# Altium schematic sheet System Input.SchDoc
size A
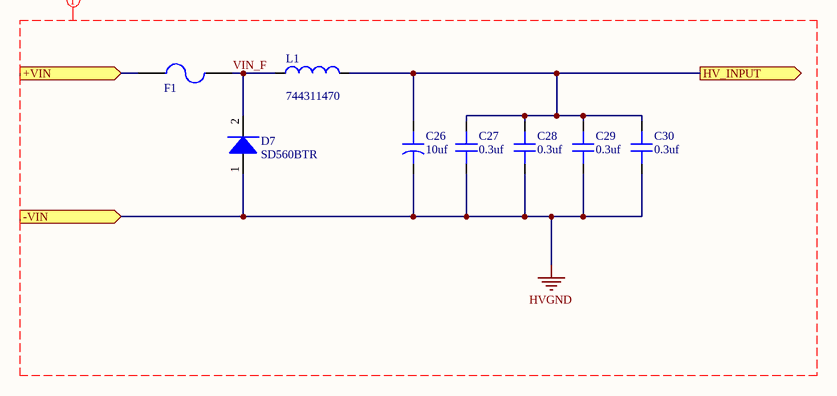
[diagram p0: System Input.SchDoc]

## Parts
C26  value 10uf  [CAP AL TH D10 L5 H30]  (hidden comment: Capacitor Electrolytic 10uf 500V CAP D10_31.5)
C27  value 0.3uf  [CAP 1812/4532 2.8MM]  (hidden comment: Capacitor MLCC 0.3uf 630V CAP 1812/4532)
C28  value 0.3uf  [CAP 1812/4532 2.8MM]  (hidden comment: Capacitor MLCC 0.3uf 630V CAP 1812/4532)
C29  value 0.3uf  [CAP 1812/4532 2.8MM]  (hidden comment: Capacitor MLCC 0.3uf 630V CAP 1812/4532)
C30  value 0.3uf  [CAP 1812/4532 2.8MM]  (hidden comment: Capacitor MLCC 0.3uf 630V CAP 1812/4532)
D7  SD560BTR  [DO214AA_ SD560BTR]
F1  Fuse  [04853,15DR]  (value not drawn)
L1  (no value)  [744311470]

## Ports
+VIN (in), -VIN (in), HV_INPUT (out)

## Nets
HVGND: C26.2 C27.1 C28.1 C29.1 C30.1 D7.1(A) ; port -VIN
+VIN: F1.1 ; port +VIN
HV_INPUT: C26.1 C27.2 C28.2 C29.2 C30.2 L1.2 ; port HV_INPUT
VIN_F: D7.2(K) F1.2 L1.1

## Layout directives
net class HV: HVGND, VIN_F

## Library data of the parts
C26 = 1093: 10µF 500V Aluminum Electrolytic Capacitors Radial, Can  8000 Hrs @ 105°C; Manufacturer_id: 1; MfrPartNo: EKXJ501ELL100MJ30S; idCapacitor: 1093; Name: Cap_10uf_500V_CAP D10_31.5; Created_By: Nick Mah; Supplier 1: Digi-Key; Supplier Part Number 1: 565-4930-ND; Drawer_id: 1; Voltage_Rating: 500V; Dielectric: Electrolytic; Package: TH D10_31.5; Link: https://www.digikey.com/product-detail/en/united-chemi-con/EKXJ501ELL100MJ30S/565-4930-ND/7809906; ComponentLink1Description: Datasheet; ComponentLink1URL: http://www.chemi-con.com/upload/files/7/6/113326760852d6c4ba03a36.pdf
C27-C30 = 1089: Null; Manufacturer_id: 1; MfrPartNo: C4532X7T2J304K250KA; idCapacitor: 1089; Name: Cap_0.3uf_630V_CAP 1812/4532; Dielectric: Ceramic; Tolerance: 10%; Created_By: Jason Zhou; Supplier 1: Digi-Key; Supplier Part Number 1: 445-13458-1-ND; Drawer_id: 1; Voltage_Rating: 630V; Package: CAP 1812/4532; Link: https://www.digikey.com/product-detail/en/tdk-corporation/C4532X7T2J304K250KA/445-13458-1-ND/3955124; ComponentLink1Description: Datasheet; ComponentLink1URL: https://product.tdk.com/info/en/catalog/datasheets/mlcc_commercial_midvoltage_en.pdf; Created_Date: 4/10/2019
D7 = 18: Diode Standard 600V 5A Surface Mount SMB; Manufacturer_id: 1; idDiode: 18; Value: 1.2V @ 5A; Created_By: Jason Zhou; mfrpartno: SD560BTR; Drawer_id: 1; Name: SD560BTR; Type: Standard; Num_Circuits: 1; Ic: 5A; Package: SMB; Link: https://www.digikey.com/product-detail/en/smc-diode-solutions/SD560BTR/1655-1530-1-ND/6022975; ComponentLink1Description: Datasheet; ComponentLink1URL: http://www.smc-diodes.com/propdf/SD560B%20N1412%20REV.D.pdf; Supplier1: Digi-Key; Supplier1PartNo: 1655-1530-1-ND; Created_Date: 4/26/2019
F1 = 10: Manufacturer_id: 1; MfrPartNo: 04853.15DR; idFuse: 10; Value: 3.15A; I_max: 6.3A; V_max: 600VDC; Created_By: Jason Zhou; Drawer_id: 1; Name: 04853,15DR; I_hold: 3.15A; Link: https://www.digikey.com/product-detail/en/littelfuse-inc/04853.15DR/F5925CT-ND/3911051; Created_Date: 4/11/2019
L1 = 6: 4.7uH Wirewound Inductor 6A 19.5 mOhm Nonstandard; Manufacturer_id: 1; idInductor: 6; Tolerance: 20%; DC_Resistance: 0.0195; SRF: 33MHz; Created_By: Jason Zhou; MfrPartNo: 744311470; Drawer_id: 1; Name: 744311470; Value: 4.7uH; Current_Rating: 6A; Package: Nonstandard; Link: https://www.digikey.com/product-detail/en/wurth-electronics-inc/744311470/732-1153-1-ND/1639214; ComponentLink1Description: Datasheet; ComponentLink1URL: https://katalog.we-online.de/pbs/datasheet/744311470.pdf; Supplier1: Digi-Key; Supplier1PartNo: 732-1153-1-ND; Created_Date: 4/11/2019